# Altium schematic sheet OutputConnection.SchDoc
size 420 x 297 mm; Address1: Address1; Address2: Address2; Address3: Address3; Address4: Address4; DocumentNumber: АБВГ.123456.001 Э3; SheetNumber: 2; Scale: 1:1; DocumentType: Схема электрическая принципиальная; FirstReferrence: АБВГ.123456.001
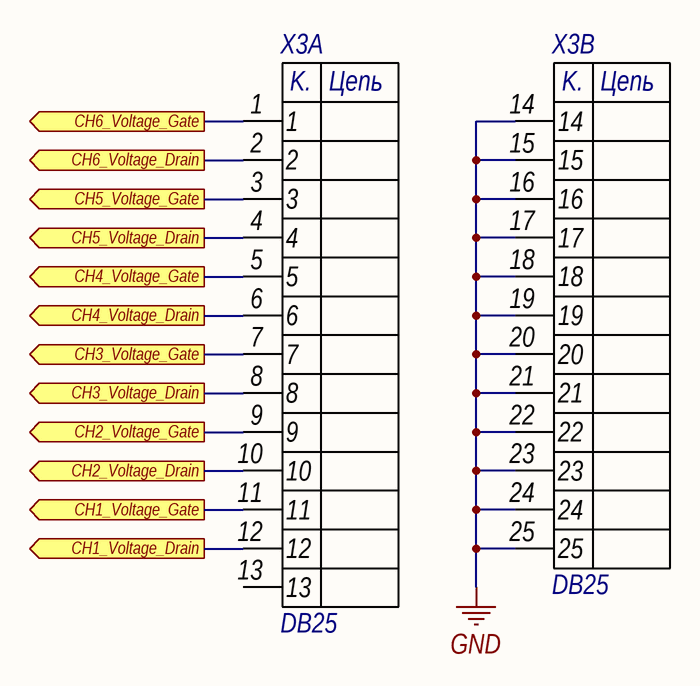
[diagram p0: OutputConnection.SchDoc]

## Parts
X3  DB25  [DB25F]  (parts A,B of 2)

## Ports
CH1_Voltage_Drain (out), CH1_Voltage_Gate (out), CH2_Voltage_Drain (out), CH2_Voltage_Gate (out), CH3_Voltage_Drain (out), CH3_Voltage_Gate (out), CH4_Voltage_Drain (out), CH4_Voltage_Gate (out), CH5_Voltage_Drain (out), CH5_Voltage_Gate (out), CH6_Voltage_Drain (out), CH6_Voltage_Gate (out)

## Nets
GND: X3.14 X3.15 X3.16 X3.17 X3.18 X3.19 X3.20 X3.21 X3.22 X3.23 X3.24 X3.25
CH1_Voltage_Drain: X3.12 ; port CH1_Voltage_Drain
CH1_Voltage_Gate: X3.11 ; port CH1_Voltage_Gate
CH2_Voltage_Drain: X3.10 ; port CH2_Voltage_Drain
CH2_Voltage_Gate: X3.9 ; port CH2_Voltage_Gate
CH3_Voltage_Drain: X3.8 ; port CH3_Voltage_Drain
CH3_Voltage_Gate: X3.7 ; port CH3_Voltage_Gate
CH4_Voltage_Drain: X3.6 ; port CH4_Voltage_Drain
CH4_Voltage_Gate: X3.5 ; port CH4_Voltage_Gate
CH5_Voltage_Drain: X3.4 ; port CH5_Voltage_Drain
CH5_Voltage_Gate: X3.3 ; port CH5_Voltage_Gate
CH6_Voltage_Drain: X3.2 ; port CH6_Voltage_Drain
CH6_Voltage_Gate: X3.1 ; port CH6_Voltage_Gate

Not connected (* = marked no-connect by the designer): X3 13

## Notes on the sheet
- Подп. и дата
- Инв. № дубл.
- Взам. инв. №
- Инв. № подл.
- Изм.
- Лист
- № докум.
- Подп.
- Дата
- 2.106-A3
- Копировал
- Формат А3
- (in symbol DB25, part A) K.; Цепь
- (in symbol DB25, part B) K.; Цепь